# EAGLE design zed_image_adapter (EAGLE 7.1.0)
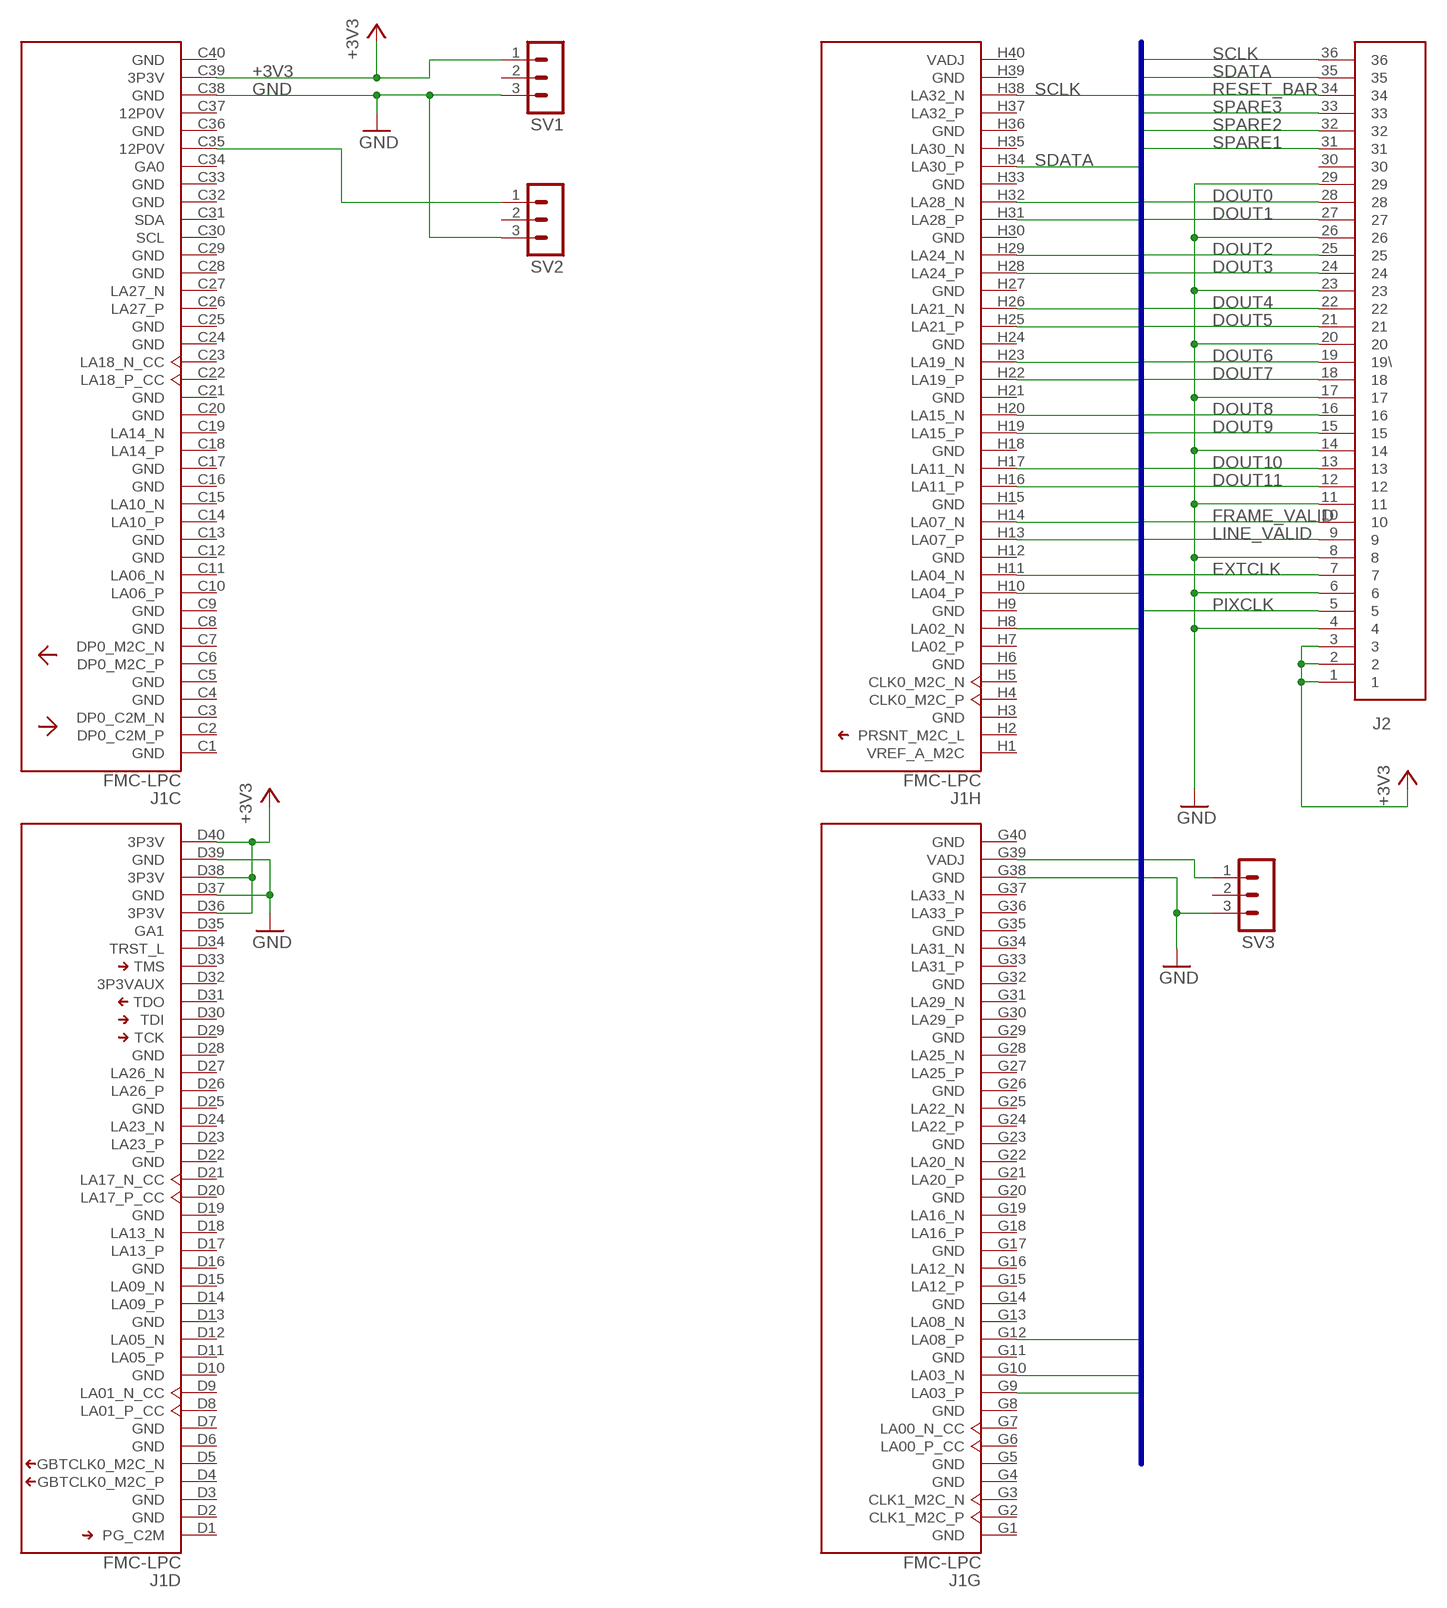
[diagram p0: schematic, sheet 1]

## Parts
J1  FMC-LPC  [FMC-LPC-MALE]
J2  MOLEX_54132_3662  [MOLEX_54132_3662]
SV1  MA03-1  [MA03-1]
SV2  MA03-1  [MA03-1]
SV3  MA03-1  [MA03-1]

## Nets
+3V3: J1.C39(C:3P3V) J1.D36(D:3P3V) J1.D38(D:3P3V) J1.D40(D:3P3V) J2.1 J2.2 J2.3 SV1.1
DOUT0: J1.H26(H:LA21_N) J2.28
DOUT1: J1.H25(H:LA21_P) J2.27
DOUT2: J1.H23(H:LA19_N) J2.25
DOUT3: J1.H22(H:LA19_P) J2.24
DOUT4: J1.H20(H:LA15_N) J2.22
DOUT5: J1.H19(H:LA15_P) J2.21
DOUT6: J1.H17(H:LA11_N) J2.19(19\)
DOUT7: J1.H16(H:LA11_P) J2.18
DOUT8: J1.H14(H:LA07_N) J2.16
DOUT9: J1.H13(H:LA07_P) J2.15
DOUT10: J1.H11(H:LA04_N) J2.13
DOUT11: J1.G9(G:LA03_P) J2.12
EXTCLK: J1.H10(H:LA04_P) J2.7
FRAME_VALID: J1.G10(G:LA03_N) J2.10
GND: J1.C38(C:GND) J1.D37(D:GND) J1.D39(D:GND) J1.G38(G:GND) J2.4 J2.6 J2.8 J2.11 J2.14 J2.17 J2.20 J2.23 J2.26 J2.29 SV1.3 SV2.3 SV3.3
LINE_VALID: J1.G12(G:LA08_P) J2.9
N$1: J1.C35(C:12P0V) SV2.1
N$2: J1.G39(G:VADJ) SV3.1
PIXCLK: J1.H8(H:LA02_N) J2.5
RESET_BAR: J1.H32(H:LA28_N) J2.34
SCLK: J1.H38(H:LA32_N) J2.36
SDATA: J1.H34(H:LA30_P) J2.35
SPARE1: J1.H31(H:LA28_P) J2.31
SPARE2: J1.H29(H:LA24_N) J2.32
SPARE3: J1.H28(H:LA24_P) J2.33
Unconnected: J1.C1(C:GND) J1.C2(C:DP0_C2M_P) J1.C3(C:DP0_C2M_N) J1.C4(C:GND) J1.C5(C:GND) J1.C6(C:DP0_M2C_P) J1.C7(C:DP0_M2C_N) J1.C8(C:GND) J1.C9(C:GND) J1.C10(C:LA06_P) J1.C11(C:LA06_N) J1.C12(C:GND) J1.C13(C:GND) J1.C14(C:LA10_P) J1.C15(C:LA10_N) J1.C16(C:GND) J1.C17(C:GND) J1.C18(C:LA14_P) J1.C19(C:LA14_N) J1.C20(C:GND) J1.C21(C:GND) J1.C22(C:LA18_P_CC) J1.C23(C:LA18_N_CC) J1.C24(C:GND) J1.C25(C:GND) J1.C26(C:LA27_P) J1.C27(C:LA27_N) J1.C28(C:GND) J1.C29(C:GND) J1.C30(C:SCL) J1.C31(C:SDA) J1.C32(C:GND) J1.C33(C:GND) J1.C34(C:GA0) J1.C36(C:GND) J1.C37(C:12P0V) J1.C40(C:GND) J1.D1(D:PG_C2M) J1.D2(D:GND) J1.D3(D:GND) J1.D4(D:GBTCLK0_M2C_P) J1.D5(D:GBTCLK0_M2C_N) J1.D6(D:GND) J1.D7(D:GND) J1.D8(D:LA01_P_CC) J1.D9(D:LA01_N_CC) J1.D10(D:GND) J1.D11(D:LA05_P) J1.D12(D:LA05_N) J1.D13(D:GND) J1.D14(D:LA09_P) J1.D15(D:LA09_N) J1.D16(D:GND) J1.D17(D:LA13_P) J1.D18(D:LA13_N) J1.D19(D:GND) J1.D20(D:LA17_P_CC) J1.D21(D:LA17_N_CC) J1.D22(D:GND) J1.D23(D:LA23_P) J1.D24(D:LA23_N) J1.D25(D:GND) J1.D26(D:LA26_P) J1.D27(D:LA26_N) J1.D28(D:GND) J1.D29(D:TCK) J1.D30(D:TDI) J1.D31(D:TDO) J1.D32(D:3P3VAUX) J1.D33(D:TMS) J1.D34(D:TRST_L) J1.D35(D:GA1) J1.G1(G:GND) J1.G2(G:CLK1_M2C_P) J1.G3(G:CLK1_M2C_N) J1.G4(G:GND) J1.G5(G:GND) J1.G6(G:LA00_P_CC) J1.G7(G:LA00_N_CC) J1.G8(G:GND) J1.G11(G:GND) J1.G13(G:LA08_N) J1.G14(G:GND) J1.G15(G:LA12_P) J1.G16(G:LA12_N) J1.G17(G:GND) J1.G18(G:LA16_P) J1.G19(G:LA16_N) J1.G20(G:GND) J1.G21(G:LA20_P) J1.G22(G:LA20_N) J1.G23(G:GND) J1.G24(G:LA22_P) J1.G25(G:LA22_N) J1.G26(G:GND) J1.G27(G:LA25_P) J1.G28(G:LA25_N) J1.G29(G:GND) J1.G30(G:LA29_P) J1.G31(G:LA29_N) J1.G32(G:GND) J1.G33(G:LA31_P) J1.G34(G:LA31_N) J1.G35(G:GND) J1.G36(G:LA33_P) J1.G37(G:LA33_N) J1.G40(G:GND) J1.H1(H:VREF_A_M2C) J1.H2(H:PRSNT_M2C_L) J1.H3(H:GND) J1.H4(H:CLK0_M2C_P) J1.H5(H:CLK0_M2C_N) J1.H6(H:GND) J1.H7(H:LA02_P) J1.H9(H:GND) J1.H12(H:GND) J1.H15(H:GND) J1.H18(H:GND) J1.H21(H:GND) J1.H24(H:GND) J1.H27(H:GND) J1.H30(H:GND) J1.H33(H:GND) J1.H35(H:LA30_N) J1.H36(H:GND) J1.H37(H:LA32_P) J1.H39(H:GND) J1.H40(H:VADJ) J2.30 SV1.2 SV2.2 SV3.2

## Buses
DOUT[0..11],SCLK,SDATA,RESET_BAR,SPARE1,SPARE2,SPARE3,FRAME_VALID,LINE_VALID,EXTCLK,PIXCLK

## Library data of the parts
J1 = dan-xilinx:FMC-LPC: FMC-LPC Bottom side connector for interfacing with Xilinx FPGA development boards (e.g. SP605); OC_NEWARK: unknown
J2 = NicksParts:MOLEX_54132_3662
SV1-SV3 = con-lstb:MA03-1: PIN HEADER; OC_FARNELL: unknown; OC_NEWARK: unknown

## Board
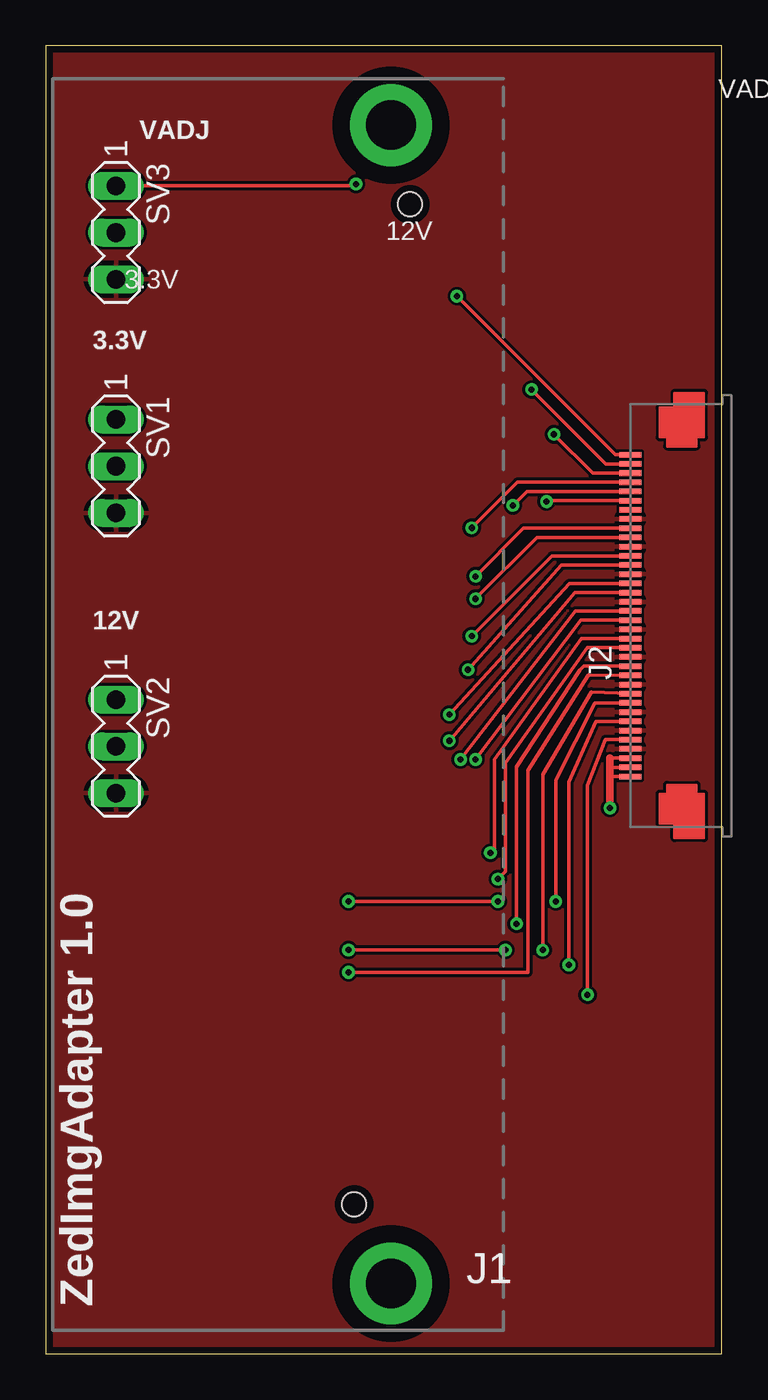
[diagram p1: board, top side]
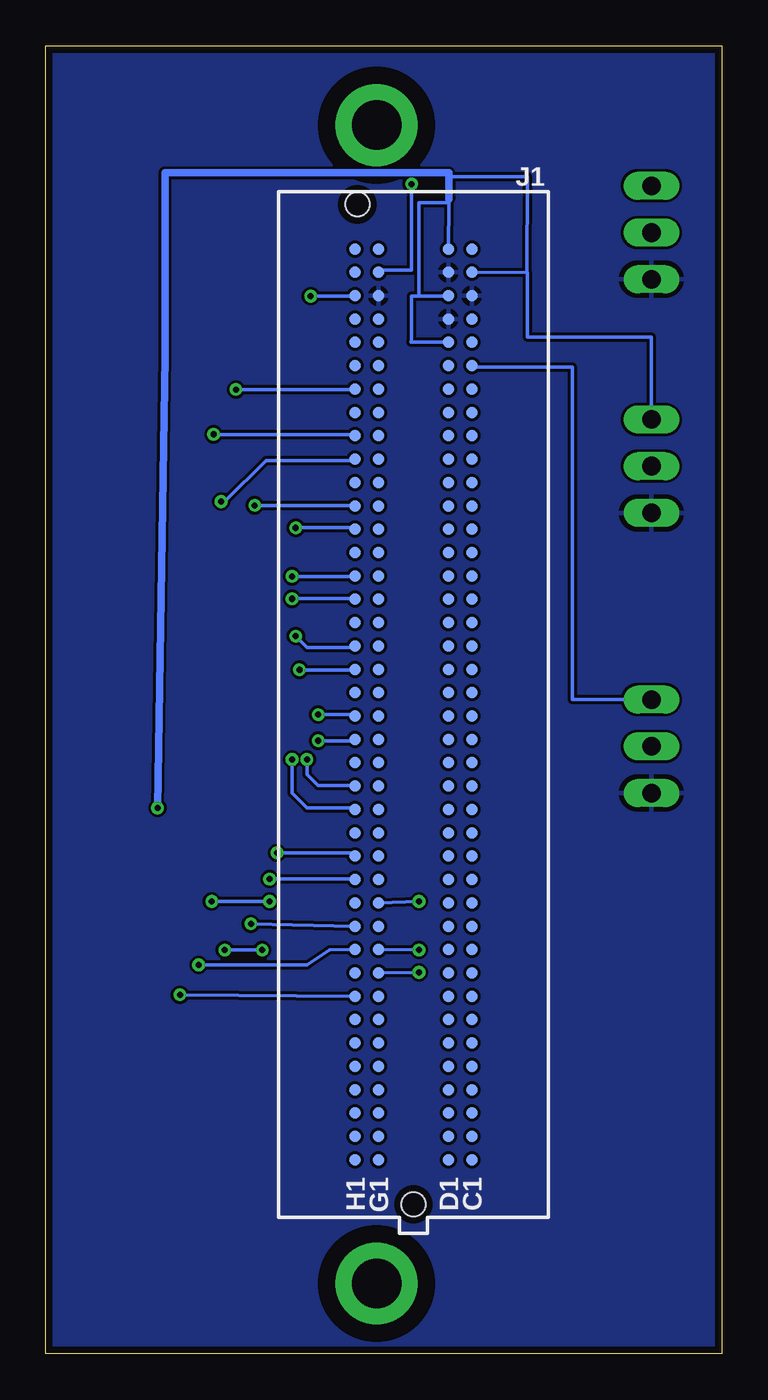
[diagram p2: board, bottom side, seen from below]

Size 36.75 x 71.11 mm. Coordinates in mm from the lower left corner, seen from the top.
Outline: 0,0 36.75,0 36.75,71.11 0,71.11 0,0
Copper layers (1*16): Top 0.0356mm / dielectric 1.5011mm / Bottom 0.0356mm
Design rules "LaenPCBOrder": minimum track width 6mil, minimum drill 13mil, track to track 6mil, track to pad 6mil, pad to pad 6mil, via to via 6mil, smd to smd 6mil, copper to edge 15mil, drill to drill 6mil, minimum pad ring 7mil, minimum via ring 7mil, stop-mask expansion 3mil, vias tented up to drill 0mil, thermal gap 10mil

### Footprints (pad centres in the part's own frame; a part is rotated, then mirrored left to right if it is on the bottom)
FMC-LPC-MALE = smd 0.635 x 0.635 bottom: C1 -3.175,-24.765; C2 -3.175,-23.495; C3 -3.175,-22.225; C4 -3.175,-20.955; C5 -3.175,-19.685; C6 -3.175,-18.415; C7 -3.175,-17.145; C8 -3.175,-15.875; C9 -3.175,-14.605; C10 -3.175,-13.335; C11 -3.175,-12.065; C12 -3.175,-10.795; C13 -3.175,-9.525; C14 -3.175,-8.255; C15 -3.175,-6.985; C16 -3.175,-5.715; C17 -3.175,-4.445; C18 -3.175,-3.175; C19 -3.175,-1.905; C20 -3.175,-0.635; C21 -3.175,0.635; C22 -3.175,1.905; C23 -3.175,3.175; C24 -3.175,4.445; C25 -3.175,5.715; C26 -3.175,6.985; C27 -3.175,8.255; C28 -3.175,9.525; C29 -3.175,10.795; C30 -3.175,12.065; C31 -3.175,13.335; C32 -3.175,14.605; C33 -3.175,15.875; C34 -3.175,17.145; C35 -3.175,18.415; C36 -3.175,19.685; C37 -3.175,20.955; C38 -3.175,22.225; C39 -3.175,23.495; C40 -3.175,24.765; D1 -1.905,-24.765; D2 -1.905,-23.495; D3 -1.905,-22.225; D4 -1.905,-20.955; D5 -1.905,-19.685; D6 -1.905,-18.415; D7 -1.905,-17.145; D8 -1.905,-15.875; D9 -1.905,-14.605; D10 -1.905,-13.335; D11 -1.905,-12.065; D12 -1.905,-10.795; D13 -1.905,-9.525; D14 -1.905,-8.255; D15 -1.905,-6.985; D16 -1.905,-5.715; D17 -1.905,-4.445; D18 -1.905,-3.175; D19 -1.905,-1.905; D20 -1.905,-0.635; D21 -1.905,0.635; D22 -1.905,1.905; D23 -1.905,3.175; D24 -1.905,4.445; D25 -1.905,5.715; D26 -1.905,6.985; D27 -1.905,8.255; D28 -1.905,9.525; D29 -1.905,10.795; D30 -1.905,12.065; D31 -1.905,13.335; D32 -1.905,14.605; D33 -1.905,15.875; D34 -1.905,17.145; D35 -1.905,18.415; D36 -1.905,19.685; D37 -1.905,20.955; D38 -1.905,22.225; D39 -1.905,23.495; D40 -1.905,24.765; G1 1.905,-24.765; G2 1.905,-23.495; G3 1.905,-22.225; G4 1.905,-20.955; G5 1.905,-19.685; G6 1.905,-18.415; G7 1.905,-17.145; G8 1.905,-15.875; G9 1.905,-14.605; G10 1.905,-13.335; G11 1.905,-12.065; G12 1.905,-10.795; G13 1.905,-9.525; G14 1.905,-8.255; G15 1.905,-6.985; G16 1.905,-5.715; G17 1.905,-4.445; G18 1.905,-3.175; G19 1.905,-1.905; G20 1.905,-0.635; G21 1.905,0.635; G22 1.905,1.905; G23 1.905,3.175; G24 1.905,4.445; G25 1.905,5.715; G26 1.905,6.985; G27 1.905,8.255; G28 1.905,9.525; G29 1.905,10.795; G30 1.905,12.065; G31 1.905,13.335; G32 1.905,14.605; G33 1.905,15.875; G34 1.905,17.145; G35 1.905,18.415; G36 1.905,19.685; G37 1.905,20.955; G38 1.905,22.225; G39 1.905,23.495; G40 1.905,24.765; H1 3.175,-24.765; H2 3.175,-23.495; H3 3.175,-22.225; H4 3.175,-20.955; H5 3.175,-19.685; H6 3.175,-18.415; H7 3.175,-17.145; H8 3.175,-15.875; H9 3.175,-14.605; H10 3.175,-13.335; H11 3.175,-12.065; H12 3.175,-10.795; H13 3.175,-9.525; H14 3.175,-8.255; H15 3.175,-6.985; H16 3.175,-5.715; H17 3.175,-4.445; H18 3.175,-3.175; H19 3.175,-1.905; H20 3.175,-0.635; H21 3.175,0.635; H22 3.175,1.905; H23 3.175,3.175; H24 3.175,4.445; H25 3.175,5.715; H26 3.175,6.985; H27 3.175,8.255; H28 3.175,9.525; H29 3.175,10.795; H30 3.175,12.065; H31 3.175,13.335; H32 3.175,14.605; H33 3.175,15.875; H34 3.175,17.145; H35 3.175,18.415; H36 3.175,19.685; H37 3.175,20.955; H38 3.175,22.225; H39 3.175,23.495; H40 3.175,24.765 | drill 2.692 pad 4.445: M1 2.007,31.496; M2 2.007,-31.496 | hole 1.321: 0,-27.191; 3.048,27.191
MOLEX_54132_3662 = smd 0.3 x 1.2: 1 -8.75,2.5; 2 -8.25,2.5; 3 -7.75,2.5; 4 -7.25,2.5; 5 -6.75,2.5; 6 -6.25,2.5; 7 -5.75,2.5; 8 -5.25,2.5; 9 -4.75,2.5; 10 -4.25,2.5; 11 -3.75,2.5; 12 -3.25,2.5; 13 -2.75,2.5; 14 -2.25,2.5; 15 -1.75,2.5; 16 -1.25,2.5; 17 -0.75,2.5; 18 -0.25,2.5; 19 0.25,2.5; 20 0.75,2.5; 21 1.25,2.5; 22 1.75,2.5; 23 2.25,2.5; 24 2.75,2.5; 25 3.25,2.5; 26 3.75,2.5; 27 4.25,2.5; 28 4.75,2.5; 29 5.25,2.5; 30 5.75,2.5; 31 6.25,2.5; 32 6.75,2.5; 33 7.25,2.5; 34 7.75,2.5; 35 8.25,2.5; 36 8.75,2.5
MA03-1 = drill 1.016 long: 1 -2.54,0; 2 0,0; 3 2.54,0

### Placement (x,y rotation side)
J1  16.76,35.31 0 top
J2  34.29,40.13 90 top
SV1  3.81,48.26 270 top
SV2  3.81,33.02 270 top
SV3  3.81,60.96 270 top

### Tracks (layer width: path | path; a pad name or v marks a point on that pad's centre or on a via)
+3V3  (via drill 0.33)
  Top 0.203: J2.3 30.68,32.38 | 30.68,31.88 J2.2 | J2.1 30.68,31.39
  Top 0.406: 30.68,32.38 30.68,31.88 30.68,31.39 v30.68,29.67
  Bottom 0.203: J1.D40 14.84,62.58 | 14.84,62.58 14.83,62.79 | J1.C39 10.59,58.78 | 10.59,58.78 10.57,64.01 14.83,64.01 | 16.46,57.51 16.87,57.51 16.87,55.04 16.89,55.04 16.89,54.99 J1.D36 | J1.D38 14.86,57.51 16.46,57.51 | 16.46,57.51 16.46,62.59 16.05,62.59 16.05,62.58 14.84,62.58 | SV1.1 3.81,55.27 10.57,55.27 10.57,58.78 10.59,58.78
  Bottom 0.406: v30.68,29.67 30.28,54.25 30.28,64.21 14.83,64.21 14.83,64.01 14.83,62.79
DOUT0  (via drill 0.33)
  Top 0.203: J2.28 25.98,44.88 v23.37,42.27
  Bottom 0.203: v23.37,42.27 19.96,42.27 J1.H26
DOUT1  (via drill 0.33)
  Top 0.203: J2.27 26.7,44.38 v23.37,41.05
  Bottom 0.203: v23.37,41.05 19.96,41.05 J1.H25
DOUT2  (via drill 0.33)
  Top 0.203: J2.25 27.53,43.38 v23.16,39.01
  Bottom 0.203: v23.16,39.01 22.55,38.41 20.02,38.41 J1.H23
DOUT3  (via drill 0.33)
  Top 0.203: J2.24 28.05,42.88 v22.96,37.19
  Bottom 0.203: v22.96,37.19 19.96,37.19 J1.H22
DOUT4  (via drill 0.33)
  Top 0.203: J2.22 28.47,41.88 v21.95,34.75
  Bottom 0.203: v21.95,34.75 20.02,34.75 J1.H20
DOUT5  (via drill 0.33)
  Top 0.203: J2.21 28.78,41.38 v21.95,33.33
  Bottom 0.203: v21.95,33.33 20.02,33.33 J1.H19
DOUT6  (via drill 0.33)
  Top 0.203: J2.19 28.8,40.38 v22.55,32.31
  Bottom 0.203: v22.55,32.31 22.55,31.5 21.95,30.89 19.96,30.89 J1.H17
DOUT7  (via drill 0.33)
  Top 0.203: J2.18 29.11,39.88 v23.37,32.31
  Bottom 0.203: v23.37,32.31 23.37,30.48 22.55,29.67 20.02,29.67 J1.H16
DOUT8  (via drill 0.33)
  Top 0.203: J2.16 29.13,38.88 24.38,32.31 24.38,27.43 v24.18,27.23
  Bottom 0.203: v24.18,27.23 20.12,27.23 J1.H14
DOUT9  (via drill 0.33)
  Top 0.203: J2.15 29.44,38.38 24.99,32.11 24.99,26.21 v24.59,25.81
  Bottom 0.203: v24.59,25.81 19.96,25.81 J1.H13
DOUT10  (via drill 0.33)
  Top 0.203: J2.13 29.25,37.38 29.06,37.19 25.6,31.9 v25.6,23.37
  Bottom 0.203: v25.6,23.37 J1.H11
DOUT11  (via drill 0.33)
  Top 0.203: J2.12 29.52,36.91 26.21,31.7 26.21,20.73 v16.46,20.73
  Bottom 0.203: v16.46,20.73 J1.G9
EXTCLK  (via drill 0.33)
  Top 0.203: J2.7 29.92,34.37 28.45,31.09 v28.45,21.13
  Bottom 0.203: v28.45,21.13 22.55,21.13 21.34,21.95 J1.H10
FRAME_VALID  (via drill 0.33)
  Top 0.203: J2.10 29.67,35.97 27.03,31.5 v27.03,21.95 | v24.99,21.95 v16.46,21.95
  Bottom 0.203: v27.03,21.95 v24.99,21.95 | v16.46,21.95 J1.G10
GND
  pour Bottom: 0.2,70.92 36.42,70.92 36.42,0.2 0.2,0.2
  pour Top: 36.42,70.71 36.42,0.2 0.41,0.2 0.41,70.71
LINE_VALID  (via drill 0.33)
  Top 0.203: J2.9 29.87,35.38 27.74,31.19 v27.74,24.59 | v24.59,24.59 v16.46,24.59
  Bottom 0.203: v27.74,24.59 v24.59,24.59 | v16.46,24.59 J1.G12
N$1
  Bottom 0.203: J1.C35 13.59,53.65 8.13,53.65 8.13,35.56 SV2.1
N$2  (via drill 0.33)
  Top 0.203: v16.87,63.6 16.87,63.5 SV3.1
  Bottom 0.203: J1.G39 18.67,58.93 16.87,58.93 v16.87,63.6
PIXCLK  (via drill 0.33)
  Top 0.203: J2.5 30.43,33.4 29.46,30.89 v29.46,19.51
  Bottom 0.203: J1.H8 v29.46,19.51
RESET_BAR  (via drill 0.33)
  Top 0.203: J2.34 29.74,47.88 v27.64,49.99
  Bottom 0.203: v27.64,49.99 20.02,49.99 J1.H32
SCLK  (via drill 0.33)
  Top 0.203: J2.36 30.98,48.88 v22.35,57.51
  Bottom 0.203: v22.35,57.51 19.96,57.51 J1.H38
SDATA  (via drill 0.33)
  Top 0.203: J2.35 30.46,48.38 v26.42,52.43
  Bottom 0.203: v26.42,52.43 19.96,52.43 J1.H34
SPARE1  (via drill 0.33)
  Top 0.203: J2.31 27.28,46.38 v27.23,46.33
  Bottom 0.203: v27.23,46.33 27.03,46.33 24.79,48.56 20.02,48.56 J1.H31
SPARE2  (via drill 0.33)
  Top 0.203: J2.32 26.16,46.88 v25.4,46.13
  Bottom 0.203: v25.4,46.13 19.96,46.13 J1.H29
SPARE3  (via drill 0.33)
  Top 0.203: J2.33 25.64,47.38 v23.16,44.91
  Bottom 0.203: v23.16,44.91 20.02,44.91 J1.H28

### Text on the board
tPlace: J1
tNames: VADJ | VADJ | 12V | 3.3V | 3.3V | 12V | ZedImgAdapter 1.0